# Altium schematic sheet neopixels.SchDoc
size 558 x 203 mm; SheetNumber: 2; SheetTotal: 3
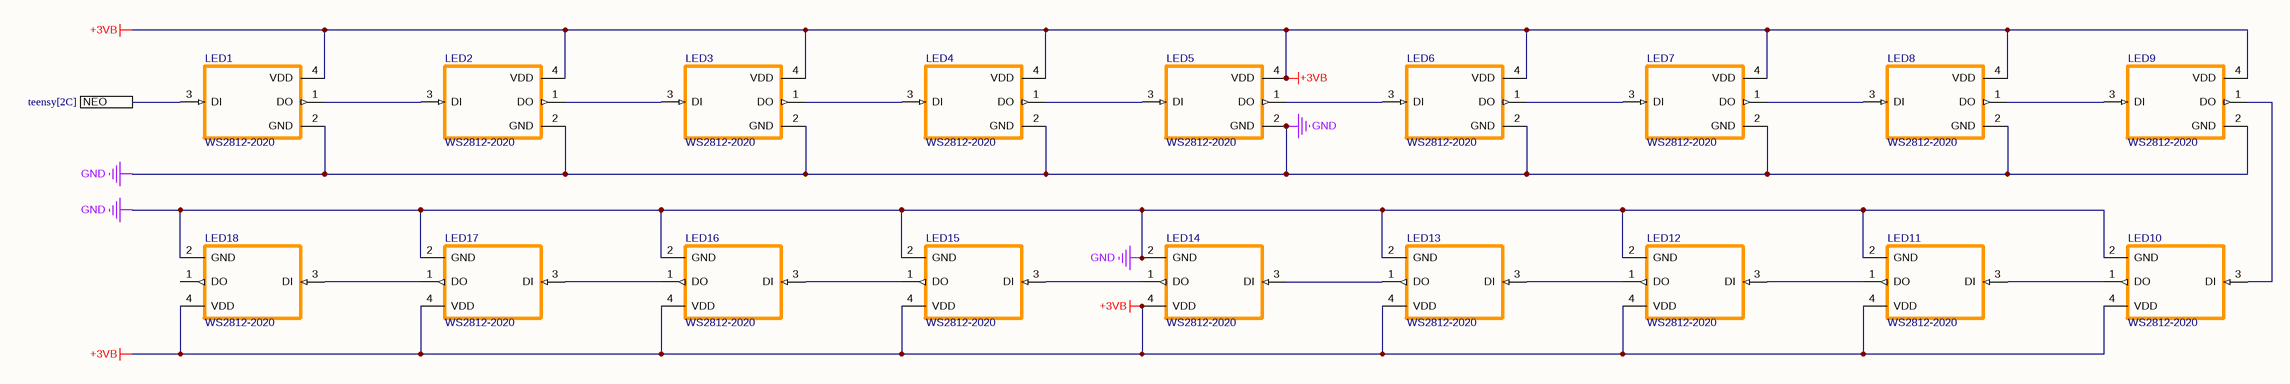
[diagram p0: neopixels.SchDoc]

## Parts
LED1  WS2812-2020  [WS2812-2020]
LED2  WS2812-2020  [WS2812-2020]
LED3  WS2812-2020  [WS2812-2020]
LED4  WS2812-2020  [WS2812-2020]
LED5  WS2812-2020  [WS2812-2020]
LED6  WS2812-2020  [WS2812-2020]
LED7  WS2812-2020  [WS2812-2020]
LED8  WS2812-2020  [WS2812-2020]
LED9  WS2812-2020  [WS2812-2020]
LED10  WS2812-2020  [WS2812-2020]
LED11  WS2812-2020  [WS2812-2020]
LED12  WS2812-2020  [WS2812-2020]
LED13  WS2812-2020  [WS2812-2020]
LED14  WS2812-2020  [WS2812-2020]
LED15  WS2812-2020  [WS2812-2020]
LED16  WS2812-2020  [WS2812-2020]
LED17  WS2812-2020  [WS2812-2020]
LED18  WS2812-2020  [WS2812-2020]

## Ports
NEO (see teensy[2C])

## Nets
+3VB: LED1.4(VDD) LED2.4(VDD) LED3.4(VDD) LED4.4(VDD) LED5.4(VDD) LED6.4(VDD) LED7.4(VDD) LED8.4(VDD) LED9.4(VDD) LED10.4(VDD) LED11.4(VDD) LED12.4(VDD) LED13.4(VDD) LED14.4(VDD) LED15.4(VDD) LED16.4(VDD) LED17.4(VDD) LED18.4(VDD)
GND: LED1.2(GND) LED2.2(GND) LED3.2(GND) LED4.2(GND) LED5.2(GND) LED6.2(GND) LED7.2(GND) LED8.2(GND) LED9.2(GND) LED10.2(GND) LED11.2(GND) LED12.2(GND) LED13.2(GND) LED14.2(GND) LED15.2(GND) LED16.2(GND) LED17.2(GND) LED18.2(GND)
NEO: LED1.3(DI) ; port NEO
NetLED1_1: LED1.1(DO) LED2.3(DI)
NetLED2_1: LED2.1(DO) LED3.3(DI)
NetLED3_1: LED3.1(DO) LED4.3(DI)
NetLED4_1: LED4.1(DO) LED5.3(DI)
NetLED5_1: LED5.1(DO) LED6.3(DI)
NetLED6_1: LED6.1(DO) LED7.3(DI)
NetLED7_1: LED7.1(DO) LED8.3(DI)
NetLED8_1: LED8.1(DO) LED9.3(DI)
NetLED9_1: LED9.1(DO) LED10.3(DI)
NetLED10_1: LED10.1(DO) LED11.3(DI)
NetLED11_1: LED11.1(DO) LED12.3(DI)
NetLED12_1: LED12.1(DO) LED13.3(DI)
NetLED13_1: LED13.1(DO) LED14.3(DI)
NetLED14_1: LED14.1(DO) LED15.3(DI)
NetLED15_1: LED15.1(DO) LED16.3(DI)
NetLED16_1: LED16.1(DO) LED17.3(DI)
NetLED17_1: LED17.1(DO) LED18.3(DI)

Not connected (* = marked no-connect by the designer): LED18 1(DO)